# Altium schematic sheet _io.SchDoc
size Tabloid
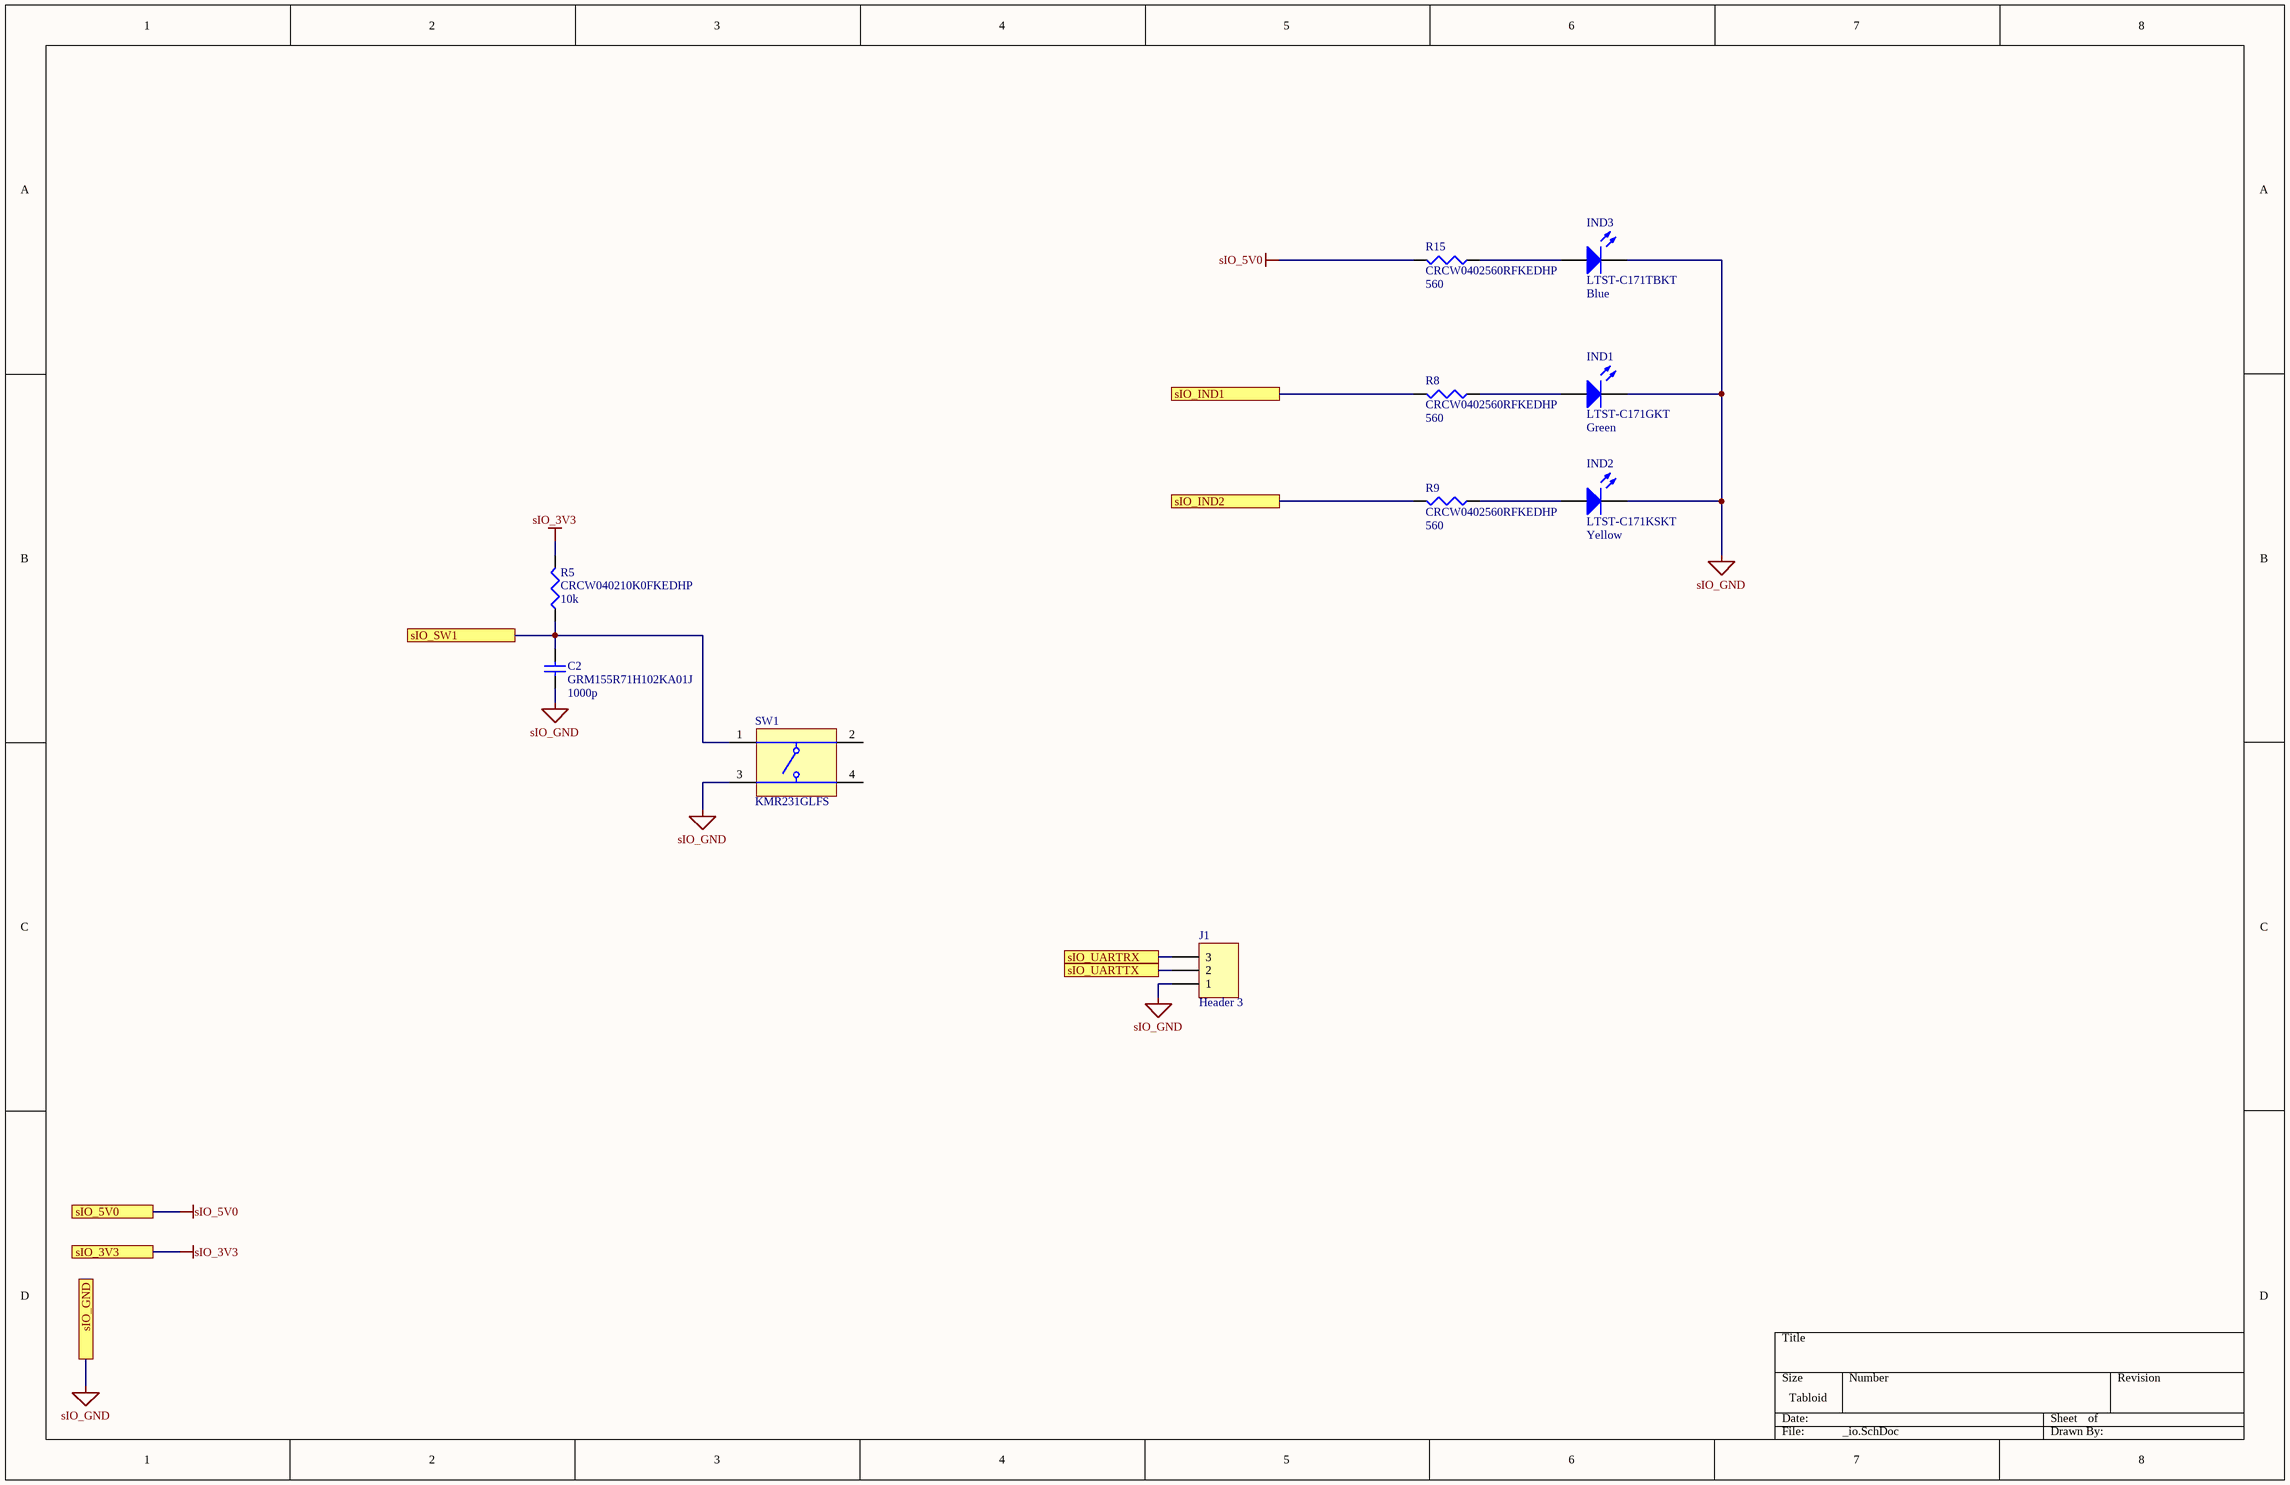
[diagram p0: _io.SchDoc]

## Parts
C2  GRM155R71H102KA01J  value 1000p  [0402]
IND1  LTST-C171GKT  Color: Green  [0805]
IND2  LTST-C171KSKT  Color: Yellow  [0805]
IND3  LTST-C171TBKT  Color: Blue  [0805]
J1  Header 3  [HDR1X3]
R5  CRCW040210K0FKEDHP  value 10k  [0402]
R8  CRCW0402560RFKEDHP  value 560  [0402]
R9  CRCW0402560RFKEDHP  value 560  [0402]
R15  CRCW0402560RFKEDHP  value 560  [0402]
SW1  KMR231GLFS  [KMR231GLFS]

## Ports
sIO_3V3, sIO_5V0, sIO_GND, sIO_IND1, sIO_IND2, sIO_SW1, sIO_UARTRX, sIO_UARTTX

## Nets
sIO_3V3: R5.2 ; port sIO_3V3
sIO_5V0: R15.2 ; port sIO_5V0
sIO_GND: C2.1 IND1.2(K) IND2.2(K) IND3.2(K) J1.1 SW1.3 ; port sIO_GND
sIO_IND1: R8.2 ; port sIO_IND1
sIO_IND2: R9.2 ; port sIO_IND2
sIO_SW1: C2.2 R5.1 SW1.1 ; port sIO_SW1
sIO_UARTRX: J1.3 ; port sIO_UARTRX
sIO_UARTTX: J1.2 ; port sIO_UARTTX
NetIND1_1: IND1.1(A) R8.1
NetIND2_1: IND2.1(A) R9.1
NetIND3_1: IND3.1(A) R15.1

Not connected (* = marked no-connect by the designer): SW1 2 4

## Library data of the parts
C2 = GRM155R71HxxxKdddd: -55-125C, 1005, 50V, X7R, ±10%
IND1 IND3 = LTST-C171GKT: LED
IND2 = LTST-C171KSKT: LED
J1 = Header 3: Header, 3-Pin; LatestRevisionDate: 17-Jul-2002; LatestRevisionNote: Re-released for DXP Platform.; Publisher: Altium Limited
R5 R8 R9 R15 = CRCW0402xxxxFKED: 0.125W, -55-155C, 1005, 50V, ±1%
SW1 = KMR231GLFS: Switch Tactile, SPST, 50 mA, 32 V, -40 to 85 degC, 4-Pin SMD, RoHS, Tape and Reel; Manufacturer: C&K Components; Mechanical Life: 150000Cycles; Switch Configuration: N.O.; Actuator Style: Button; Ground Terminal: Yes; Maximum DC Voltage Rating: 32V; Minimum Insulation Resistance: >=1000MOhm; Dielectric Strength: >=250Vrms; Operating Force: 3N; Illumination Type: N/R; Body Orientation: Straight; Contact Rating @ Voltage: 1A; Actuator Length: 0.5mm; Operating Temperature: -40to85C; Electrical Life: N/A; Housing Material: N/A; ECCN: EAR99; Pole Throw Configuration: SPST; Contact Plating: Silver; Dimension: 2.8x4.6x1.9mm; Type: Micro-Miniature; Product Weight: N/A; Package Description: 4-Pin Surface Mount Device, Body 4.6 x 2.8 mm; Actuator Color: N/A; HTS: 8536501199; Mounting Technology: SurfaceMount; Mounting: SurfaceMount,GullWing; Seal Location: N/A; Base Material: N/A; Family: KMR2; Part No: KMR231GLFS; Datasheet Version: 06/2016; Contact Material: Silver; Package Reference: KMR231GLFS; Manufacturer URL: http://www.ckswitches.com/; Maximum AC Voltage Rating: N/A; Datasheet URL: http://www.ck-components.com/media/1479/kmr2.pdf; RoHS: Yes; Seal Description: N/A; Packaging: TapeandReel; Supplier: C&KComponents